# EasyEDA schematic Audio connector breakout.json
TITLE: Audio connector breakout; REV: 1.0; Date: 2021-12-02; Sheet: 1/1
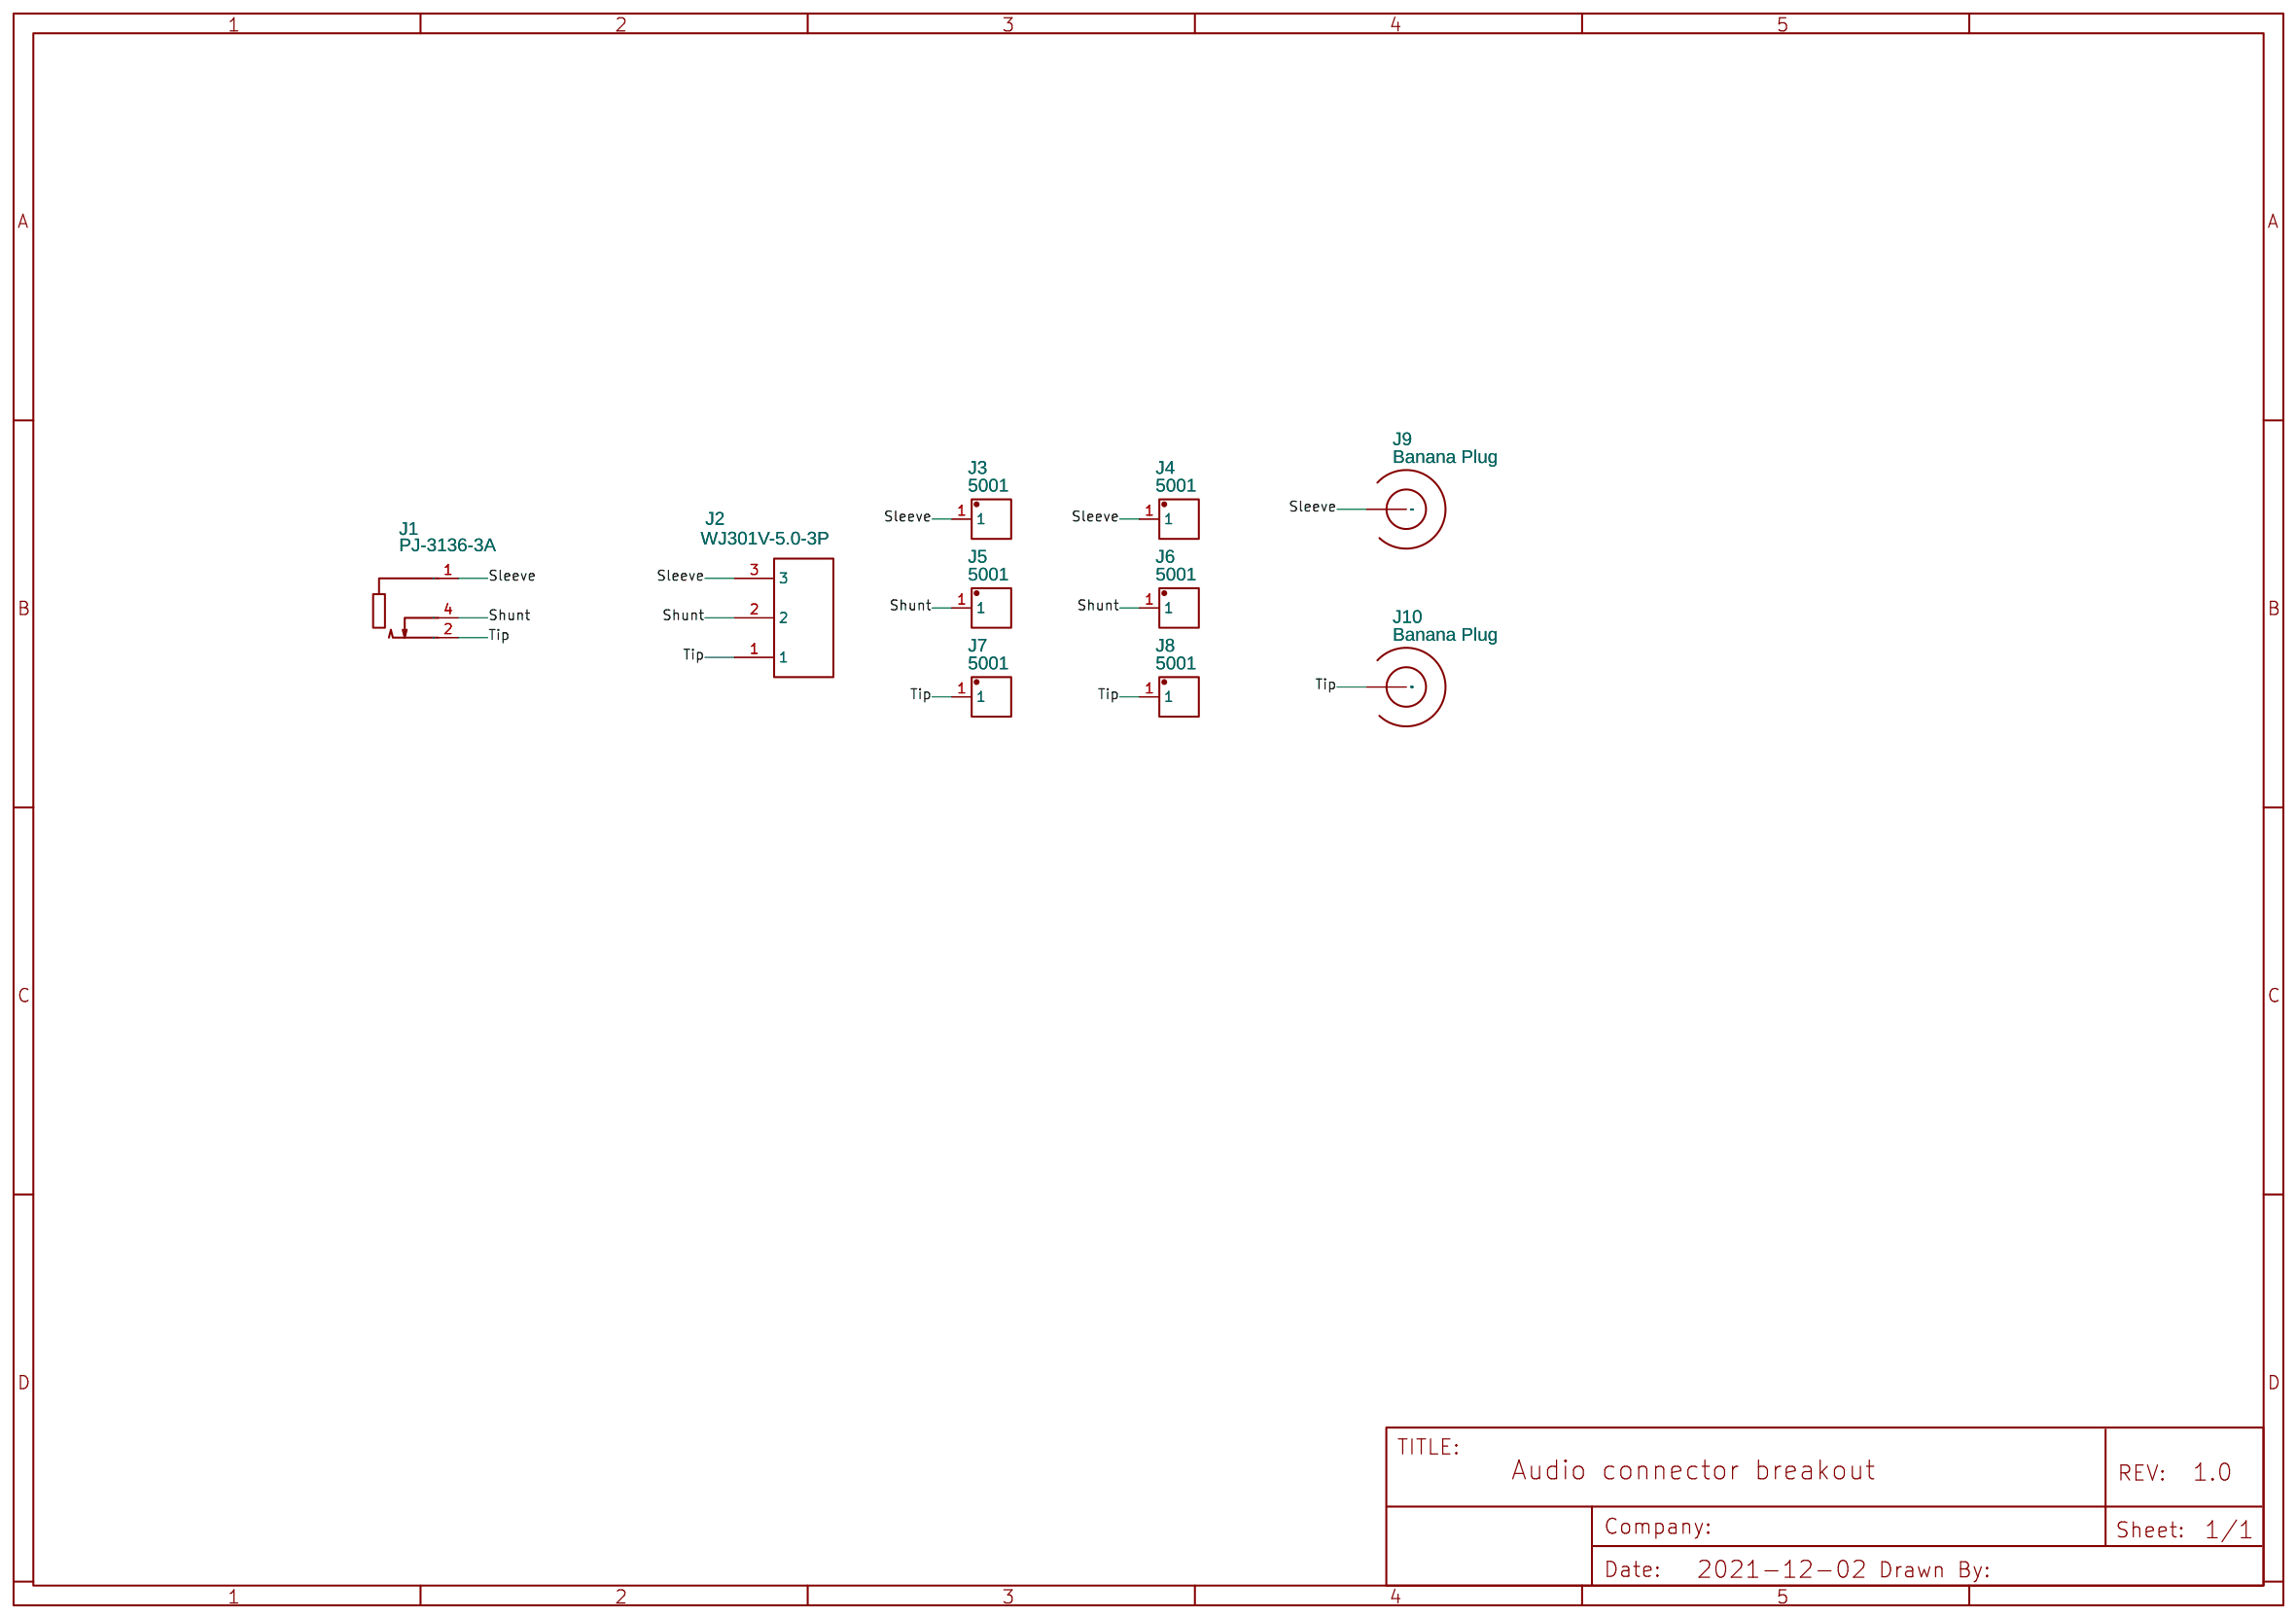
[diagram p0: schematic sheet]

## Parts
J1  PJ-3136-3A  [AUDIO-TH_PJ-3136-3A]
J2  WJ301V-5.0-3P  [CONN-TH_2P-P5.00_WJ301V-5.00-3P]
J3  5001  [TEST-TH_BD2.54-P1.39]
J4  5001  [TEST-TH_BD2.54-P1.39]
J5  5001  [TEST-TH_BD2.54-P1.39]
J6  5001  [TEST-TH_BD2.54-P1.39]
J7  5001  [TEST-TH_BD2.54-P1.39]
J8  5001  [TEST-TH_BD2.54-P1.39]
J9  Banana Plug  [BANANA PLUG]
J10  Banana Plug  [BANANA PLUG]

## Library data of the parts
J1 = PJ-3136-3A: Supplier: LCSC; Supplier Part: C707248; Manufacturer: Korean Hroparts Elec; Contributor: LCSC; JLCPCB Part Class: Extended Part
J2 = WJ301V-5.0-3P: Supplier: LCSC; Manufacturer: ReliaPro; Supplier Part: C8483; JLCPCB Part Class: Extended Part
J3-J8 = 5001: Supplier: LCSC; Supplier Part: C238122; Manufacturer: Keystone; Contributor: LCSC; JLCPCB Part Class: Extended Part
J9 J10 = Banana Plug: Manufacturer: Multicomp; Manufacturer Part: 24.247.2; Supplier: Element14; Supplier Part: 169-8951; link: https://au.element14.com/multicomp/24-247-2/receptacle-32a-4mm-panel-black/dp/1698951; Contributor: s.cbird01

## Nets
Shunt: J1.4 J2.2 J5.1 J6.1
Sleeve: J1.1 J2.3 J3.1 J4.1 J9.1(Banana Plug)
Tip: J1.2 J2.1 J7.1 J8.1 J10.1(Banana Plug)
